# Altium schematic sheet Tango V1.0.SchDoc
size A2; PageSetup: Record=PageOptions|CenterHorizontal=True|CenterVertical=True|PrintScale=0.49|XCorrection=1.00|YCorrection=1.00|PrintKind=0|BorderSize=5000000|LeftOffset=0|BottomOffset=0|Orientation=2|PaperLength=1000|PaperWidth=1000|Scale=100|PaperSource=7|PrintQuality=-4|MediaType=1|DitherType=10|PaperKind=A4|PrintScaleMode=1
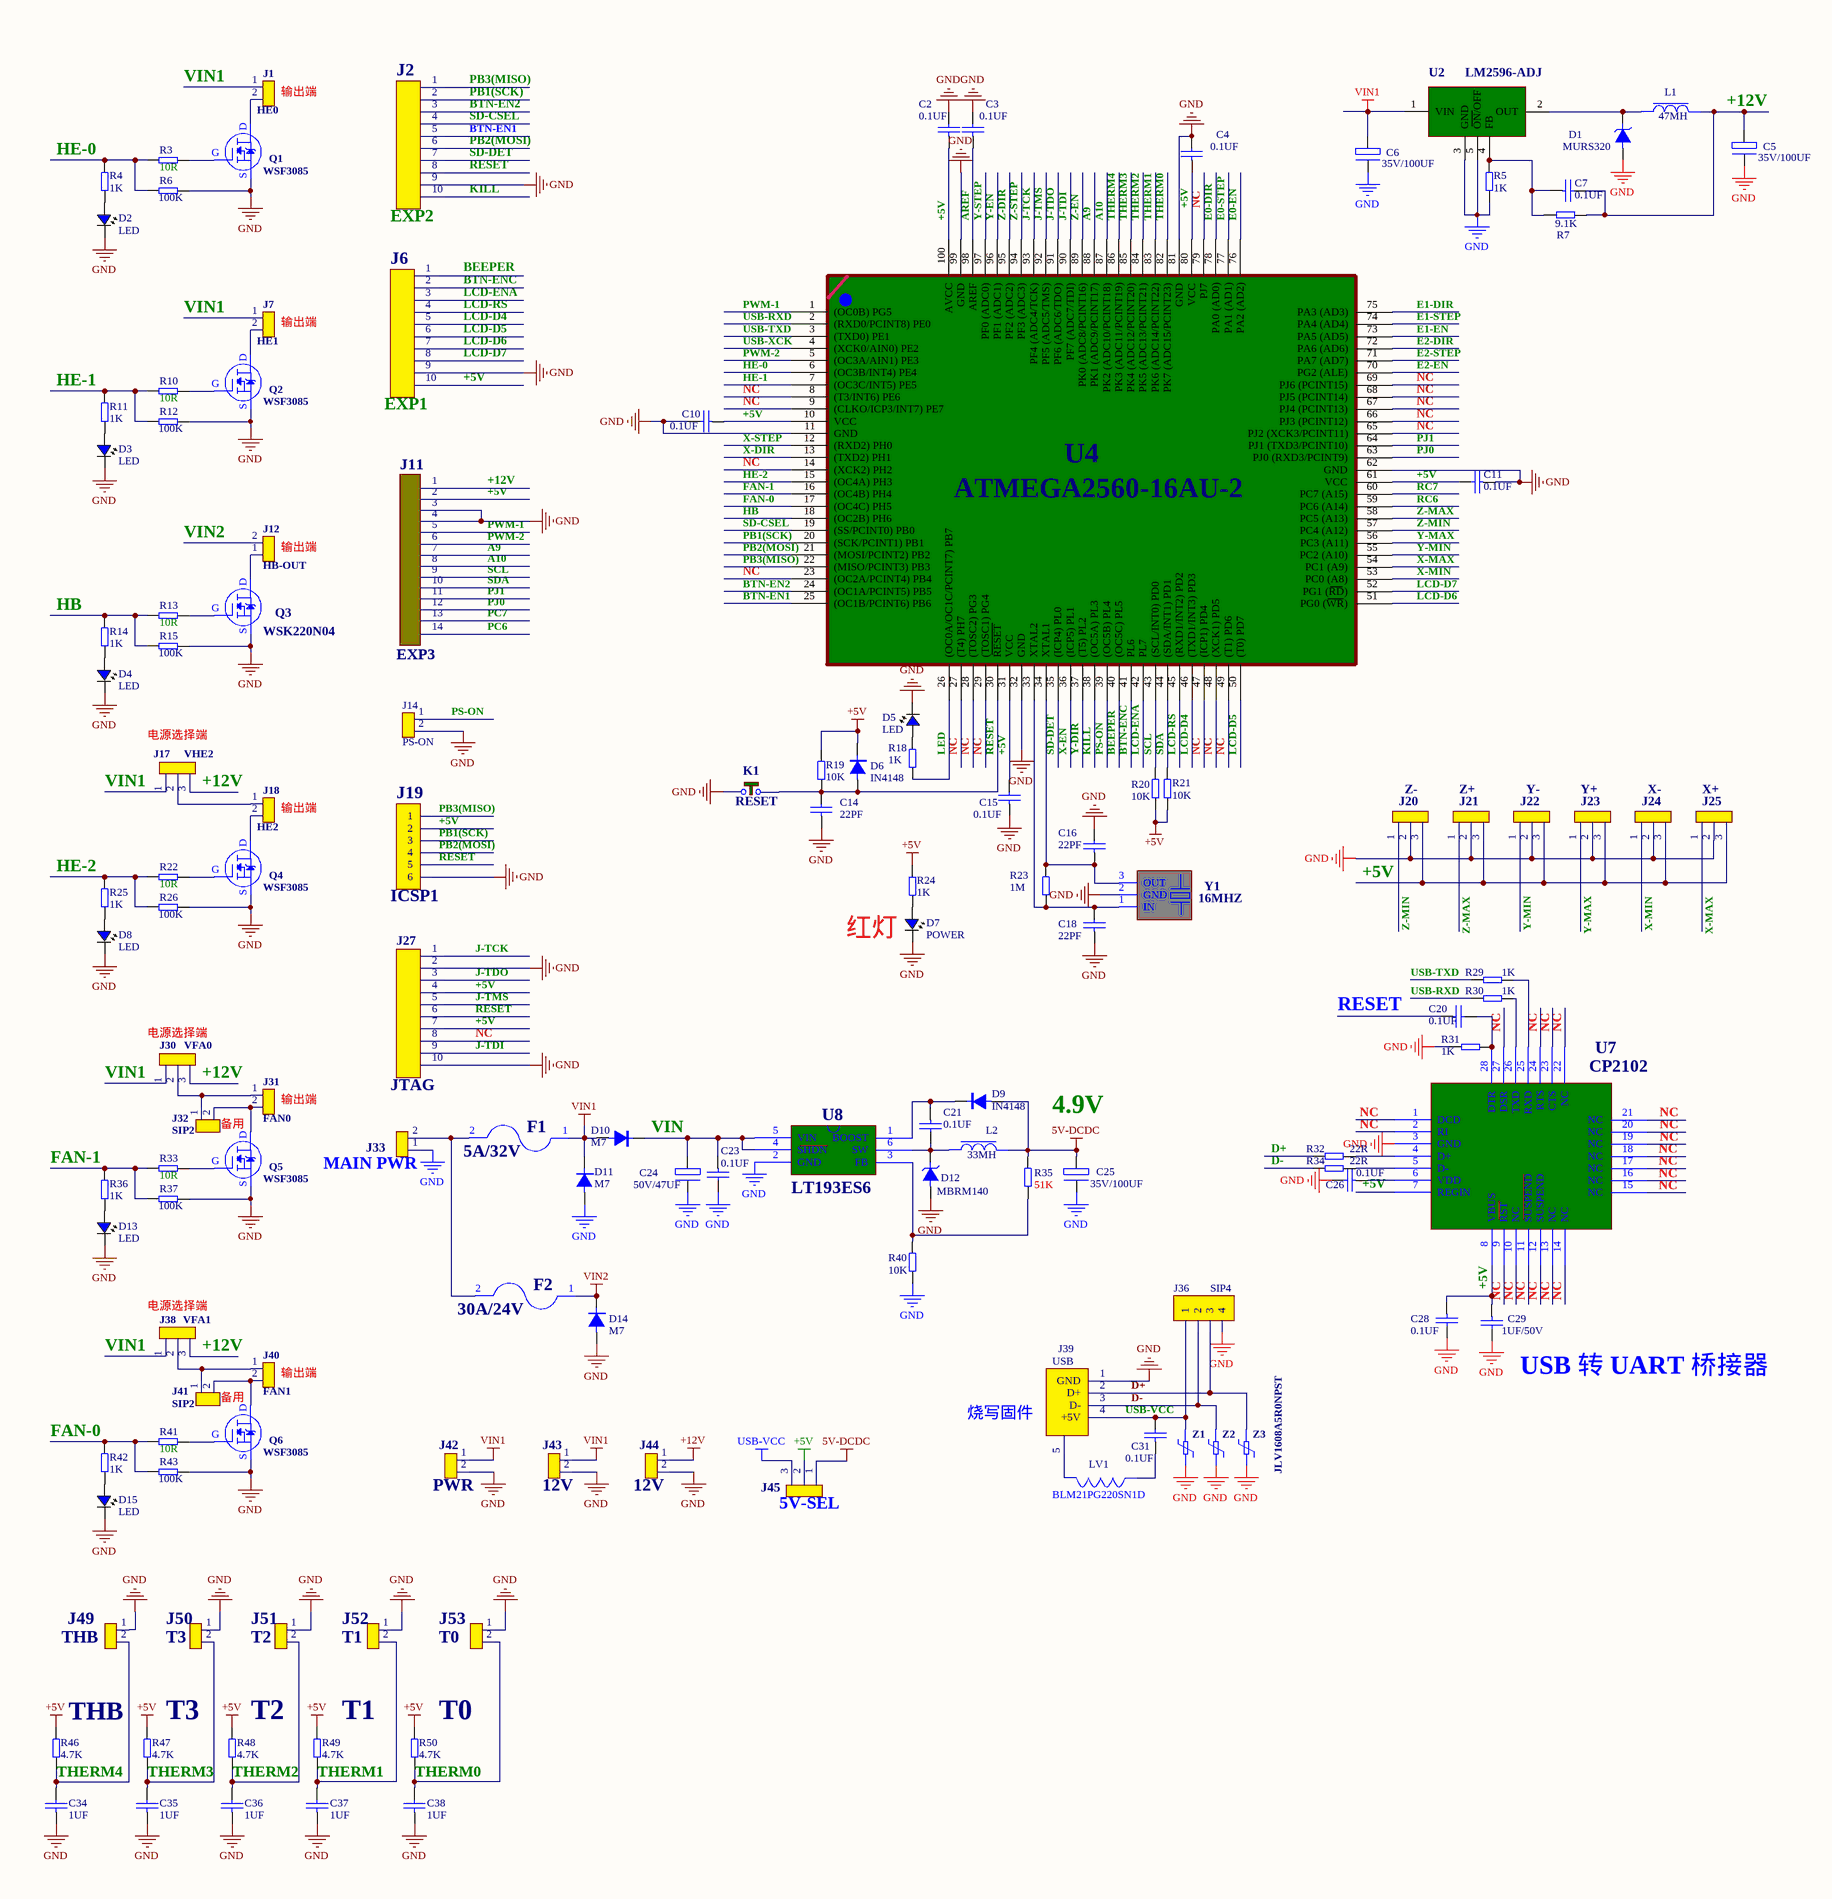
[diagram p0: Tango V1.0.SchDoc, left]
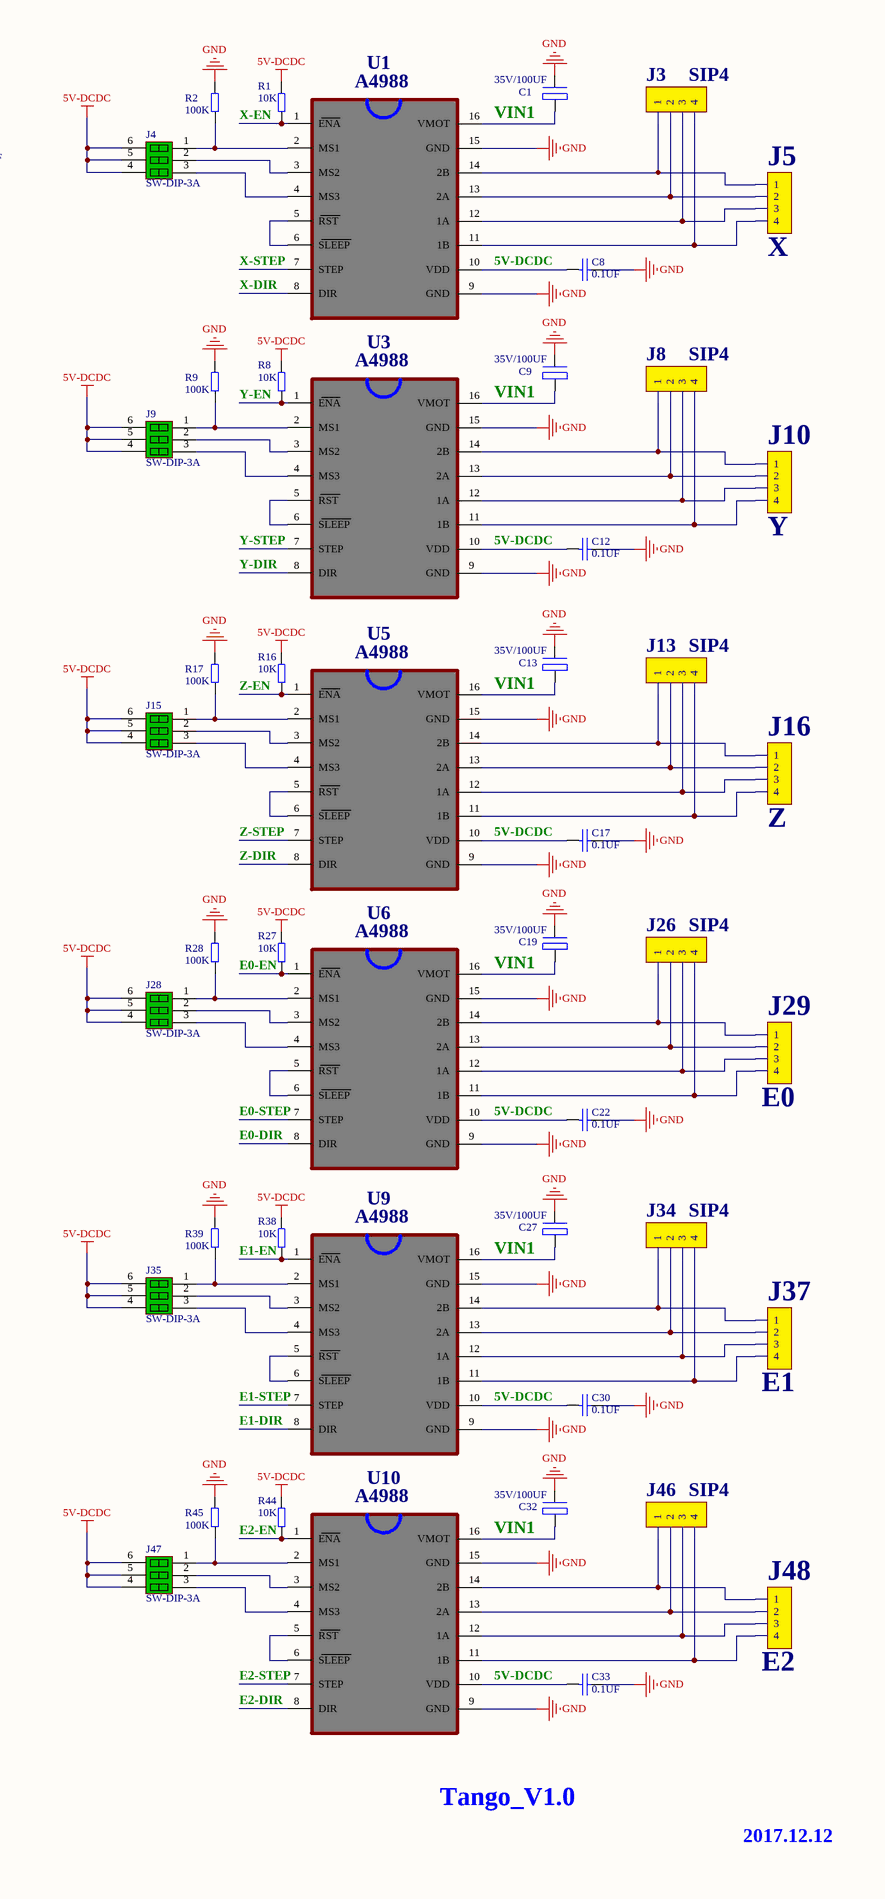
[diagram p1: Tango V1.0.SchDoc, right]

## Parts
C1  35V/100UF  [35V/100UF-2]
C2  0.1UF  [0603N]
C3  0.1UF  [0603N]
C4  0.1UF  [0603N]
C5  35V/100UF  [35V/100UF-2]
C6  35V/100UF  [35V/100UF-2]
C7  0.1UF  [0603N]
C8  0.1UF  [0603N]
C9  35V/100UF  [35V/100UF-2]
C10  0.1UF  [0603N]
C11  0.1UF  [0603N]
C12  0.1UF  [0603N]
C13  35V/100UF  [35V/100UF-2]
C14  22PF  [0603N]
C15  0.1UF  [0603N]
C16  22PF  [0603N]
C17  0.1UF  [0603N]
C18  22PF  [0603N]
C19  35V/100UF  [35V/100UF-2]
C20  0.1UF  [0603N]
C21  0.1UF  [0603N]
C22  0.1UF  [0603N]
C23  0.1UF  [0603N]
C24  50V/47UF  [35V/100UF-2]
C25  35V/100UF  [35V/100UF-2]
C26  0.1UF  [0603N]
C27  35V/100UF  [35V/100UF-2]
C28  0.1UF  [0603N]
C29  1UF/50V  [0603N]
C30  0.1UF  [0603N]
C31  0.1UF  [0603N]
C32  35V/100UF  [35V/100UF-2]
C33  0.1UF  [0603N]
C34  1UF  [0805N]
C35  1UF  [0805N]
C36  1UF  [0805N]
C37  1UF  [0805N]
C38  1UF  [0805N]
D1  MURS320  [DO-214AB]
D2  LED  [LED-0603]
D3  LED  [LED-0603]
D4  LED  [LED-0603]
D5  LED  [LED-0603]
D6  IN4148  [1206-DIDEO]
D7  POWER  [LED-0603]
D8  LED  [LED-0603]
D9  IN4148  [1206-DIDEO]
D10  M7  [DO-214AC]
D11  M7  [DO-214AC]
D12  MBRM140  [MBRM140]
D13  LED  [LED-0603]
D14  M7  [DO-214AC]
D15  LED  [LED-0603]
F1  5A/32V  [1206]
F2  30A/24V  [1206]
J1  HE0  [5.08-2-B]
J2  EXP2  [IDC10-2.54]
J3  SIP4  [SIP4]
J4  SW-DIP-3A  [Header 3X2-B]
J5  X  [2.54-4P-2]
J6  EXP1  [IDC10-2.54]
J7  HE1  [5.08-2-B]
J8  SIP4  [SIP4]
J9  SW-DIP-3A  [Header 3X2-B]
J10  Y  [2.54-4P-2]
J11  EXP3  [Header 7X2]
J12  HB-OUT  [5.08-2]
J13  SIP4  [SIP4]
J14  PS-ON  [SIP2]
J15  SW-DIP-3A  [Header 3X2-B]
J16  Z  [2.54-4P-2]
J17  VHE2  [SIP3]
J18  HE2  [5.08-2-B]
J19  ICSP1  [Header 3X2]
J20  Z-  [2.54-3P-2]
J21  Z+  [2.54-3P-2]
J22  Y-  [2.54-3P-2]
J23  Y+  [2.54-3P-2]
J24  X-  [2.54-3P-2]
J25  X+  [2.54-3P-2]
J26  SIP4  [SIP4]
J27  JTAG  [Header 5X2]
J28  SW-DIP-3A  [Header 3X2-B]
J29  E0  [2.54-4P-2]
J30  VFA0  [SIP3]
J31  FAN0  [5.08-2-B]
J32  SIP2  [SIP2]
J33  MAIN PWR  [5.08-2]
J34  SIP4  [SIP4]
J35  SW-DIP-3A  [Header 3X2-B]
J36  SIP4  [SIP4]
J37  E1  [2.54-4P-2]
J38  VFA1  [SIP3]
J39  USB  [USB-B-3]
J40  FAN1  [5.08-2-B]
J41  SIP2  [SIP2]
J42  PWR  [SIP2]
J43  12V  [2.54-2P-2]
J44  12V  [2.54-2P-2]
J45  5V-SEL  [SIP3]
J46  SIP4  [SIP4]
J47  SW-DIP-3A  [Header 3X2-B]
J48  E2  [2.54-4P-2]
J49  THB  [2.54-2P-2]
J50  T3  [2.54-2P-2]
J51  T2  [2.54-2P-2]
J52  T1  [2.54-2P-2]
J53  T0  [2.54-2P-2]
K1  RESET  [K-VX]
L1  47MH  [15MH]
L2  33MH  [7.5*7.5]
LV1  BLM21PG220SN1D  [0805N]
Q1  WSF3085  [TO-252-B]
Q2  WSF3085  [TO-252-B]
Q3  WSK220N04  [TO-263-B]
Q4  WSF3085  [TO-252-B]
Q5  WSF3085  [TO-252-B]
Q6  WSF3085  [TO-252-B]
R1  10K  [0603N]
R2  100K  [0603N]
R3  10R  [0603N]
R4  1K  [0603N]
R5  1K  [0603N]
R6  100K  [0603N]
R7  9.1K  [0603N]
R8  10K  [0603N]
R9  100K  [0603N]
R10  10R  [0603N]
R11  1K  [0603N]
R12  100K  [0603N]
R13  10R  [0603N]
R14  1K  [0603N]
R15  100K  [0603N]
R16  10K  [0603N]
R17  100K  [0603N]
R18  1K  [0603N]
R19  10K  [0603N]
R20  10K  [0603N]
R21  10K  [0603N]
R22  10R  [0603N]
R23  1M  [0603N]
R24  1K  [0603N]
R25  1K  [0603N]
R26  100K  [0603N]
R27  10K  [0603N]
R28  100K  [0603N]
R29  1K  [0603N]
R30  1K  [0603N]
R31  1K  [0603N]
R32  22R  [0603N]
R33  10R  [0603N]
R34  22R  [0603N]
R35  51K  [0603N]
R36  1K  [0603N]
R37  100K  [0603N]
R38  10K  [0603N]
R39  100K  [0603N]
R40  10K  [0603N]
R41  10R  [0603N]
R42  1K  [0603N]
R43  100K  [0603N]
R44  10K  [0603N]
R45  100K  [0603N]
R46  4.7K  [0603N]
R47  4.7K  [0603N]
R48  4.7K  [0603N]
R49  4.7K  [0603N]
R50  4.7K  [0603N]
U1  A4988  [A4988]
U2  LM2596-ADJ  [TO-263(S)]
U3  A4988  [A4988]
U4  ATMEGA2560-16AU-2  [TQFP-100-B]
U5  A4988  [A4988]
U6  A4988  [A4988]
U7  CP2102  [QFN-28]
U8  LT193ES6  [SOT23-6]
U9  A4988  [A4988]
U10  A4988  [A4988]
Y1  16MHZ  [SMD-3]
Z1  JLV1608A5R0NPST  [0603N]  (value not drawn)
Z2  JLV1608A5R0NPST  [0603N]  (value not drawn)
Z3  JLV1608A5R0NPST  [0603N]

## Nets
5V-DCDC: C8.1 C12.1 C17.1 C22.1 C25.1(+) C30.1 C33.1 D9.1(A) J4.4 J4.5 J4.6 J9.4 J9.5 J9.6 J15.4 J15.5 J15.6 J28.4 J28.5 J28.6 J35.4 J35.5 J35.6 J45.1 J47.4 J47.5 J47.6 L2.2 R1.1 R8.1 R16.1 R27.1 R35.1 R38.1 R44.1 U1.10(VDD) U3.10(VDD) U5.10(VDD) U6.10(VDD) U9.10(VDD) U10.10(VDD)
+5V: C2.1 C4.1 C10.1 C11.2 C15.2 C28.1 C29.1 D6.2(K) J6.10 J11.2 J19.2 J20.3 J21.3 J22.3 J23.3 J24.3 J25.3 J27.4 J27.7 J45.2 R19.1 R20.2 R21.2 R24.2 R46.1 R47.1 R48.1 R49.1 R50.1 U4.10(VCC) U4.31(VCC) U4.61(VCC) U4.80(VCC) U4.100(AVCC) U7.7(REGIN) U7.8(VBUS)
+12V: C5.1(+) C7.2 J11.1 J17.3 J30.3 J38.3 J44.1 L1.2 R7.2
GND: C1.2(-) C2.2 C3.2 C4.2 C5.2(-) C6.2(-) C8.2 C9.2(-) C10.2 C11.1 C12.2 C13.2(-) C14.1 C15.1 C16.2 C17.2 C18.1 C19.2(-) C22.2 C23.2 C24.2(-) C25.2(-) C26.2 C27.2(-) C28.2 C29.2 C30.2 C32.2(-) C33.2 C34.1 C35.1 C36.1 C37.1 C38.1 D1.1(A) D2.2(K) D3.2(K) D4.2(K) D5.2(K) D7.2(K) D8.2(K) D11.1(A) D12.1(A) D13.2(K) D14.1(A) D15.2(K) J2.9 J6.9 J11.3 J11.4 J14.2 J19.6 J20.2 J21.2 J22.2 J23.2 J24.2 J25.2 J27.2 J27.10 J33.1 J36.4 J39.1(GND) J42.2 J43.2 J44.2 J49.1 J50.1 J51.1 J52.1 J53.1 K1.1 Q1.S Q2.S Q3.S Q4.S Q5.S Q6.S R2.1 R5.2 R6.1 R9.1 R12.1 R15.1 R17.1 R26.1 R28.1 R31.1 R37.1 R39.1 R40.2 R43.1 R45.1 U1.9(GND) U1.15(GND) U2.3(GND) U2.5(ON/OFF) U3.9(GND) U3.15(GND) U4.11(GND) U4.32(GND) U4.62(GND) U4.81(GND) U4.99(GND) U5.9(GND) U5.15(GND) U6.9(GND) U6.15(GND) U7.3(GND) U8.2(GND) U9.9(GND) U9.15(GND) U10.9(GND) U10.15(GND) Y1.2(GND) Z1.1 Z2.1 Z3.1
USB-VCC: C31.2 J36.1 J39.4(+5V) J45.3 Z1.2
VIN1: C1.1(+) C6.1(+) C9.1(+) C13.1(+) C19.1(+) C27.1(+) C32.1(+) D10.1(A) D11.2(K) F1.1 J1.1 J7.1 J17.1 J30.1 J38.1 J42.1 J43.1 U1.16(VMOT) U2.1(VIN) U3.16(VMOT) U5.16(VMOT) U6.16(VMOT) U9.16(VMOT) U10.16(VMOT)
VIN2: D14.2(K) F2.1 J12.2
A9: J11.7 U4.88(PK1_(ADC9/PCINT17))
A10: J11.8 U4.87(PK2_(ADC10/PCINT18))
AREF: C3.1 U4.98(AREF)
BEEPER: J6.1 U4.40((OC5C)_PL5)
BTN-EN1: J2.5 U4.25((OC1B/PCINT6)_PB6)
BTN-EN2: J2.3 U4.24((OC1A/PCINT5)_PB5)
BTN-ENC: J6.2 U4.41(PL6)
D+: J36.3 J39.2(D+) R32.2 Z3.2
D-: J36.2 J39.3(D-) R34.2 Z2.2
E0-DIR: U4.78(PA0_(AD0)) U6.8(DIR)
E0-EN: R27.2 U4.76(PA2_(AD2)) U6.1(ENA)
E0-STEP: U4.77(PA1_(AD1)) U6.7(STEP)
E1-DIR: U4.75(PA3_(AD3)) U9.8(DIR)
E1-EN: R38.2 U4.73(PA5_(AD5)) U9.1(ENA)
E1-STEP: U4.74(PA4_(AD4)) U9.7(STEP)
E2-DIR: U4.72(PA6_(AD6)) U10.8(DIR)
E2-EN: R44.2 U4.70(PG2_(ALE)) U10.1(ENA)
E2-STEP: U4.71(PA7_(AD7)) U10.7(STEP)
FAN-0: R41.2 R42.1 R43.2 U4.17((OC4C)_PH5)
FAN-1: R33.2 R36.1 R37.2 U4.16((OC4B)_PH4)
HB: R13.2 R14.1 R15.2 U4.18((OC2B)_PH6)
HE-0: R3.2 R4.1 R6.2 U4.6((OC3B/INT4)_PE4)
HE-1: R10.2 R11.1 R12.2 U4.7((OC3C/INT5)_PE5)
HE-2: R22.2 R25.1 R26.2 U4.15((OC4A)_PH3)
J-TCK: J27.1 U4.93(PF4_(ADC4/TCK))
J-TDI: J27.9 U4.90(PF7_(ADC7/TDI))
J-TDO: J27.3 U4.91(PF6_(ADC6/TDO))
J-TMS: J27.5 U4.92(PF5_(ADC5/TMS))
KILL: J2.10 U4.38((OC5A)_PL3)
LCD-D4: J6.5 U4.46((TXD1/INT3)_PD3)
LCD-D5: J6.6 U4.50((T0)_PD7)
LCD-D6: J6.7 U4.51(PG0_(WR))
LCD-D7: J6.8 U4.52(PG1_(RD))
LCD-ENA: J6.3 U4.42(PL7)
LCD-RS: J6.4 U4.45((RXD1/INT2)_PD2)
LED: R18.2 U4.26((OC0A/OC1C/PCINT7)_PB7)
PB1(SCK): J2.2 J19.3 U4.20((SCK/PCINT1)_PB1)
PB2(MOSI): J2.6 J19.4 U4.21((MOSI/PCINT2)_PB2)
PB3(MISO): J2.1 J19.1 U4.22((MISO/PCINT3)_PB3)
PC6: J11.14
PC7: J11.13
PJ0: J11.12 U4.63(PJ0_(RXD3/PCINT9))
PJ1: J11.11 U4.64(PJ1_(TXD3/PCINT10))
PS-ON: J14.1 U4.39((OC5B)_PL4)
PWM-1: J11.5 U4.1((OC0B)_PG5)
PWM-2: J11.6 U4.5((OC3A/AIN1)_PE3)
RC6: U4.59(PC6_(A14))
RC7: U4.60(PC7_(A15))
RESET: C14.2 C20.1 D6.1(A) J2.8 J19.5 J27.6 K1.2 R19.2 U4.30(RESET)
SCL: J11.9 R20.1 U4.43((SCL/INT0)_PD0)
SD-CSEL: J2.4 U4.19((SS/PCINT0)_PB0)
SD-DET: J2.7 U4.35((ICP4)_PL0)
SDA: J11.10 R21.1 U4.44((SDA/INT1)_PD1)
THERM0: C38.2 J53.2 R50.2 U4.82(PK7_(ADC15/PCINT23))
THERM1: C37.2 J52.2 R49.2 U4.83(PK6_(ADC14/PCINT22))
THERM2: C36.2 J51.2 R48.2 U4.84(PK5_(ADC13/PCINT21))
THERM3: C35.2 J50.2 R47.2 U4.85(PK4_(ADC12/PCINT20))
THERM4: C34.2 J49.2 R46.2 U4.86(PK3_(ADC11/PCINT19))
USB-RXD: R30.1 U4.2((RXD0/PCINT8)_PE0)
USB-TXD: R29.1 U4.3((TXD0)_PE1)
USB-XCK: U4.4((XCK0/AIN0)_PE2)
VIN: C23.1 C24.1(+) D10.2(K) U8.4(SHDN) U8.5(VIN)
X-DIR: U1.8(DIR) U4.13((TXD2)_PH1)
X-EN: R1.2 U1.1(ENA) U4.36((ICP5)_PL1)
X-MAX: J25.1 U4.54(PC1_(A9))
X-MIN: J24.1 U4.53(PC0_(A8))
X-STEP: U1.7(STEP) U4.12((RXD2)_PH0)
Y-DIR: U3.8(DIR) U4.37((T5)_PL2)
Y-EN: R8.2 U3.1(ENA) U4.96(PF1_(ADC1))
Y-MAX: J23.1 U4.56(PC3_(A11))
Y-MIN: J22.1 U4.55(PC2_(A10))
Y-STEP: U3.7(STEP) U4.97(PF0_(ADC0))
Z-DIR: U4.95(PF2_(ADC2)) U5.8(DIR)
Z-EN: R16.2 U4.89(PK0_(ADC8/PCINT16)) U5.1(ENA)
Z-MAX: J21.1 U4.58(PC5_(A13))
Z-MIN: J20.1 U4.57(PC4_(A12))
Z-STEP: U4.94(PF3_(ADC3)) U5.7(STEP)
NetC7_1: C7.1 R5.1 R7.1 U2.4(FB)
NetC16_1: C16.1 R23.1 U4.34(XTAL1) Y1.3(OUT)
NetC18_2: C18.2 R23.2 U4.33(XTAL2) Y1.1(IN)
NetC20_2: C20.2 R31.2 U7.28(DTR)
NetC21_1: C21.1 D9.2(K) U8.1(BOOST)
NetC21_2: C21.2 D12.2(K) L2.1 U8.6(SW)
NetC26_1: C26.1 U7.6(VDD)
NetC31_1: C31.1 LV1.1
NetD1_2: D1.2(K) L1.1 U2.2(OUT)
NetD2_1: D2.1(A) R4.2
NetD3_1: D3.1(A) R11.2
NetD4_1: D4.1(A) R14.2
NetD5_1: D5.1(A) R18.1
NetD7_1: D7.1(A) R24.1
NetD8_1: D8.1(A) R25.2
NetD13_1: D13.1(A) R36.2
NetD15_1: D15.1(A) R42.2
NetF1_2: F1.2 F2.2 J33.2
NetJ1_2: J1.2 Q1.D
NetJ3_1: J3.1 J5.1 U1.14(2B)
NetJ3_2: J3.2 J5.2 U1.13(2A)
NetJ3_3: J3.3 J5.3 U1.12(1A)
NetJ3_4: J3.4 J5.4 U1.11(1B)
NetJ4_1: J4.1 R2.2 U1.2(MS1)
NetJ4_2: J4.2 U1.3(MS2)
NetJ4_3: J4.3 U1.4(MS3)
NetJ7_2: J7.2 Q2.D
NetJ8_1: J8.1 J10.1 U3.14(2B)
NetJ8_2: J8.2 J10.2 U3.13(2A)
NetJ8_3: J8.3 J10.3 U3.12(1A)
NetJ8_4: J8.4 J10.4 U3.11(1B)
NetJ9_1: J9.1 R9.2 U3.2(MS1)
NetJ9_2: J9.2 U3.3(MS2)
NetJ9_3: J9.3 U3.4(MS3)
NetJ12_1: J12.1 Q3.D
NetJ13_1: J13.1 J16.1 U5.14(2B)
NetJ13_2: J13.2 J16.2 U5.13(2A)
NetJ13_3: J13.3 J16.3 U5.12(1A)
NetJ13_4: J13.4 J16.4 U5.11(1B)
NetJ15_1: J15.1 R17.2 U5.2(MS1)
NetJ15_2: J15.2 U5.3(MS2)
NetJ15_3: J15.3 U5.4(MS3)
NetJ17_2: J17.2 J18.1
NetJ18_2: J18.2 Q4.D
NetJ26_1: J26.1 J29.1 U6.14(2B)
NetJ26_2: J26.2 J29.2 U6.13(2A)
NetJ26_3: J26.3 J29.3 U6.12(1A)
NetJ26_4: J26.4 J29.4 U6.11(1B)
NetJ28_1: J28.1 R28.2 U6.2(MS1)
NetJ28_2: J28.2 U6.3(MS2)
NetJ28_3: J28.3 U6.4(MS3)
NetJ30_2: J30.2 J31.1 J32.1
NetJ31_2: J31.2 J32.2 Q5.D
NetJ34_1: J34.1 J37.1 U9.14(2B)
NetJ34_2: J34.2 J37.2 U9.13(2A)
NetJ34_3: J34.3 J37.3 U9.12(1A)
NetJ34_4: J34.4 J37.4 U9.11(1B)
NetJ35_1: J35.1 R39.2 U9.2(MS1)
NetJ35_2: J35.2 U9.3(MS2)
NetJ35_3: J35.3 U9.4(MS3)
NetJ38_2: J38.2 J40.1 J41.1
NetJ39_5: J39.5 LV1.2
NetJ40_2: J40.2 J41.2 Q6.D
NetJ46_1: J46.1 J48.1 U10.14(2B)
NetJ46_2: J46.2 J48.2 U10.13(2A)
NetJ46_3: J46.3 J48.3 U10.12(1A)
NetJ46_4: J46.4 J48.4 U10.11(1B)
NetJ47_1: J47.1 R45.2 U10.2(MS1)
NetJ47_2: J47.2 U10.3(MS2)
NetJ47_3: J47.3 U10.4(MS3)
NetQ1_G: Q1.G R3.1
NetQ2_G: Q2.G R10.1
NetQ3_G: Q3.G R13.1
NetQ4_G: Q4.G R22.1
NetQ5_G: Q5.G R33.1
NetQ6_G: Q6.G R41.1
NetR29_2: R29.2 U7.25(RXD)
NetR30_2: R30.2 U7.26(TXD)
NetR32_1: R32.1 U7.4(D+)
NetR34_1: R34.1 U7.5(D-)
NetR35_2: R35.2 R40.1 U8.3(FB)
NetU1_5: U1.5(RST) U1.6(SLEEP)
NetU3_5: U3.5(RST) U3.6(SLEEP)
NetU5_5: U5.5(RST) U5.6(SLEEP)
NetU6_5: U6.5(RST) U6.6(SLEEP)
NetU9_5: U9.5(RST) U9.6(SLEEP)
NetU10_5: U10.5(RST) U10.6(SLEEP)

Not connected (* = marked no-connect by the designer): J27 8; U4 8((T3/INT6)_PE6) 9((CLKO/ICP3/INT7)_PE7) 14((XCK2)_PH2) 23((OC2A/PCINT4)_PB4) 27((T4)_PH7) 28((TOSC2)_PG3) 29((TOSC1)_PG4) 47((ICP1)_PD4) 48((XCK1)_PD5) 49((T1)_PD6) 65(PJ2_(XCK3/PCINT11)) 66(PJ3_(PCINT12)) 67(PJ4_(PCINT13)) 68(PJ5_(PCINT14)) 69(PJ6_(PCINT15)) 79(PJ7); U7 1(DCD) 2(RI) 9(RST) 10(NC) 11(SUSPEND) 12(SUSPEND) 13(NC) 14(NC) 15(NC) 16(NC) 17(NC) 18(NC) 19(NC) 20(NC) 21(NC) 22(NC) 23(CTS) 24(RTS) 27(DSR)

## Notes on the sheet
- (near J1) 输出端
- (near C4) NC
- (near J7) 输出端
- (near C10) NC
- NC
- (near J12) 输出端
- (near J17) 电源选择端
- (near J18) 输出端
- 红灯
- (near J30) 电源选择端
- (near J32) 备用
- (near J31) 输出端
- 4.9V
- (near U7) NC
- (near J38) 电源选择端
- (near C29) NC
- (near J40) 输出端
- (near C29) USB 转 UART 桥接器
- (near J41) 备用
- 烧写固件
- (near R46) THB
- (near R47) T3
- (near R48) T2
- (near R49) T1
- (near R50) T0
- Tango_V1.0
- 2017.12.12

## Library data of the parts
C1 C5 C6 C9 C13 C19 C24 C25 C27 C32 = C
C2-C4 C7 C8 C10-C12 C14-C18 C20-C23 C26 C28-C31 C33-C38 = CAP
D1 D12 = ZENEVR
D6 D9-D11 D14 = DIODE
D7 = LED
F1 F2 = FUSE
J1 J7 J12 J14 J18 J31 J33 J40 J42-J44 J49-J53 = SIP2
J2 J6 J27 = SIP10
J5 J10 J16 J29 J37 J48 = SIP4
J11 = SIP14
J17 J20-J25 J30 J38 J45 = SIP3
J19 = SIP6
J39 = SIP5-USB
K1 = K3
L1 L2 = L1
LV1 = L
Q1 Q2 Q4-Q6 = VS3060AD
Q3 = NMOS
R1-R50 = RES
U2 = LM2596
U8 = LT1933ES6
Y1 = SMD-3
Z1-Z3 = RV?